# EAGLE schematic secondary_18 (EAGLE 6.1)
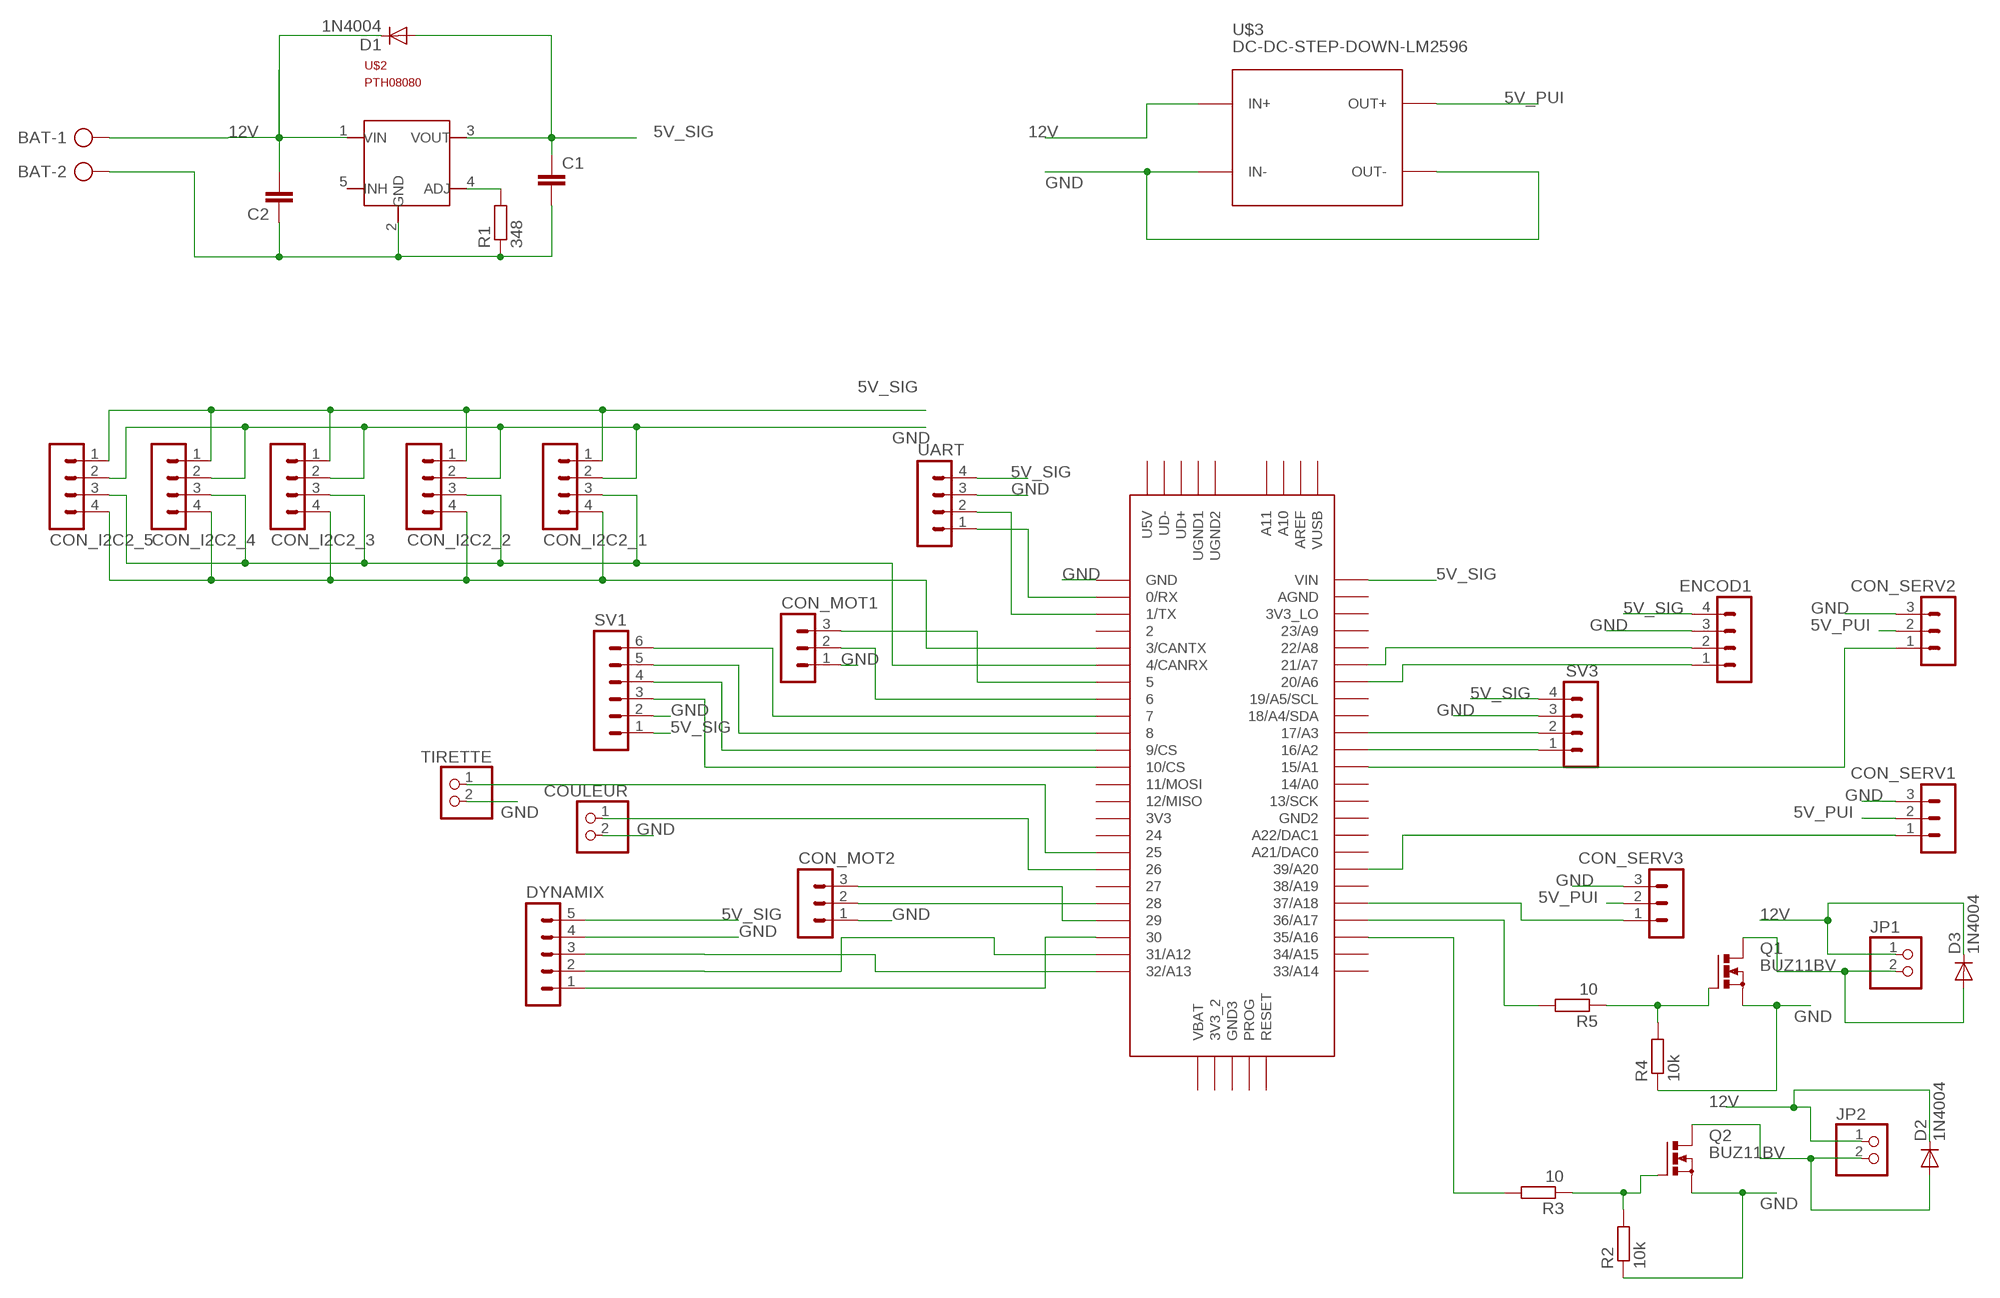
[diagram p0: schematic, sheet 1]

## Parts
BAT  AK300/2  [AK300/2]
C1  C-EU025-060X050  [C025-060X050]
C2  C-EU025-060X050  [C025-060X050]
CON_I2C2_1  MA04-1  [MA04-1]
CON_I2C2_2  MA04-1  [MA04-1]
CON_I2C2_3  MA04-1  [MA04-1]
CON_I2C2_4  MA04-1  [MA04-1]
CON_I2C2_5  MA04-1  [MA04-1]
CON_MOT1  MA03-1  [MA03-1]
CON_MOT2  MA03-1  [MA03-1]
CON_SERV1  MA03-1  [MA03-1]
CON_SERV2  MA03-1  [MA03-1]
CON_SERV3  MA03-1  [MA03-1]
COULEUR  PINHD-1X2  [1X02]
D1  1N4004  [DO41-10]
D2  1N4004  [DO41-10]
D3  1N4004  [DO41-10]
DYNAMIX  MA05-1  [MA05-1]
ENCOD1  MA04-1  [MA04-1]
JP1  PINHD-1X2  [1X02]
JP2  PINHD-1X2  [1X02]
Q1  BUZ11BV  [TO220BV]
Q2  BUZ11BV  [TO220BV]
R1  348  R-EU_0204/7  [0204/7]
R2  10k  R-EU_0204/7  [0204/7]
R3  10  R-EU_0204/7  [0204/7]
R4  10k  R-EU_0204/7  [0204/7]
R5  10  R-EU_0204/7  [0204/7]
SV1  MA06-1  [MA06-1]
SV3  MA04-1  [MA04-1]
TIRETTE  PINHD-1X2  [1X02]
U$1  TEENSY_3.5/3.6  [TEENSY_3.5/3.6]
U$2  PTH08080  [PTH08080EUF]
U$3  DC-DC-STEP-DOWN-LM2596  [DC-DC-STEP-DOWN-LM2596]
UART  MA04-1  [MA04-1]

## Nets
5V_PUI: CON_SERV1.2 CON_SERV2.2 CON_SERV3.2 U$3.OUT+
5V_SIG: C1.1 CON_I2C2_1.1 CON_I2C2_2.1 CON_I2C2_3.1 CON_I2C2_4.1 CON_I2C2_5.1 D1.A DYNAMIX.5 ENCOD1.4 SV1.1 SV3.4 U$1.VIN U$2.3(VOUT) UART.4
12V: BAT.1 C2.2 D1.C D2.C D3.C JP1.1 JP2.1 U$2.1(VIN) U$3.IN+
GND: BAT.2 C1.2 C2.1 CON_I2C2_1.2 CON_I2C2_2.2 CON_I2C2_3.2 CON_I2C2_4.2 CON_I2C2_5.2 CON_MOT1.1 CON_MOT2.1 CON_SERV1.3 CON_SERV2.3 CON_SERV3.3 COULEUR.2 DYNAMIX.4 ENCOD1.3 Q1.S Q2.S R1.1 R2.1 R4.1 SV1.2 SV3.3 TIRETTE.2 U$1.GND U$2.2(GND) U$3.IN- U$3.OUT- UART.3
N$1: R1.2 U$2.4(ADJ)
N$2: CON_MOT2.3 U$1.29
N$3: CON_MOT1.3 U$1.5
N$4: CON_MOT1.2 U$1.6
N$5: CON_MOT2.2 U$1.28
N$6: Q2.G R2.2 R3.1
N$7: R3.2 U$1.35/A16
N$8: D2.A JP2.2 Q2.D
N$9: SV3.1 U$1.16/A2
N$10: Q1.G R4.2 R5.1
N$11: R5.2 U$1.36/A17
N$12: D3.A JP1.2 Q1.D
N$13: SV3.2 U$1.17/A3
N$14: ENCOD1.1 U$1.20/A6
N$15: ENCOD1.2 U$1.21/A7
N$16: CON_SERV2.1 U$1.15/A1
N$17: CON_SERV3.1 U$1.37/A18
N$18: DYNAMIX.3 U$1.32/A13
N$19: CON_SERV1.1 U$1.39/A20
N$20: DYNAMIX.2 U$1.31/A12
N$21: CON_I2C2_1.4 CON_I2C2_2.4 CON_I2C2_3.4 CON_I2C2_4.4 CON_I2C2_5.4 U$1.3/CANTX
N$22: COULEUR.1 U$1.26
N$23: CON_I2C2_1.3 CON_I2C2_2.3 CON_I2C2_3.3 CON_I2C2_4.3 CON_I2C2_5.3 U$1.4/CANRX
N$24: DYNAMIX.1 U$1.30
N$25: TIRETTE.1 U$1.25
N$26: U$1.1/TX UART.2
N$27: U$1.0/RX UART.1
N$30: SV1.3 U$1.10/CS
N$31: SV1.4 U$1.9/CS
N$32: SV1.5 U$1.8
N$33: SV1.6 U$1.7
Unconnected: U$1.2 U$1.3V3 U$1.3V3_2 U$1.3V3_LO U$1.11/MOSI U$1.12/MISO U$1.13/SCK U$1.14/A0 U$1.18/A4/SDA U$1.19/A5/SCL U$1.21/DAC0(A21/DAC0) U$1.22/A8 U$1.23/A9 U$1.24 U$1.27 U$1.33/A14 U$1.34/A15 U$1.38/A19 U$1.A10 U$1.A11 U$1.A22/DAC1 U$1.AGND U$1.AREF U$1.GND2 U$1.GND3 U$1.PROG U$1.RESET U$1.U5V U$1.UD+ U$1.UD- U$1.UGND1 U$1.UGND2 U$1.VBAT U$1.VUSB U$2.5(INH)

## Library data of the parts
BAT = con-ptr500:AK300/2: CONNECTOR; OC_FARNELL: unknown; OC_NEWARK: unknown
C1 C2 = rcl:C-EU: CAPACITOR, European symbol
CON_I2C2_1-CON_I2C2_5 ENCOD1 SV3 UART = con-lstb:MA04-1: PIN HEADER; OC_FARNELL: unknown; OC_NEWARK: unknown
CON_MOT1 CON_MOT2 CON_SERV1-CON_SERV3 = con-lstb:MA03-1: PIN HEADER; OC_FARNELL: unknown; OC_NEWARK: unknown
COULEUR JP1 JP2 TIRETTE = pinhead:PINHD-1X2: PIN HEADER
D1-D3 = diode:1N4004: DIODE general purpose rectifier, 1 A
DYNAMIX = con-lstb:MA05-1: PIN HEADER; OC_FARNELL: unknown; OC_NEWARK: unknown
Q1 Q2 = transistor-power:BUZ11: N-CHANNEL MOS FET
R1-R5 = resistor:R-EU_: RESISTOR, European symbol
SV1 = con-lstb:MA06-1: PIN HEADER; OC_FARNELL: unknown; OC_NEWARK: unknown
U$1 = Teensy356:TEENSY_3.5/3.6
U$2 = pth08080:PTH08080: DC-DC, Vin 5..18V, Vout 2..6V, 2A www.ti.com
U$3 = diy-modules:DC-DC-STEP-DOWN-LM2596: DC/DC Step-Down Regulator based on LM2596-ADJ chip LM2596 datasheet available here: http://www.ti.com/lit/ds/symlink/lm2596.pdf Click here to find device on ebay.com <http://www.ebay.com/sch/lm2596+power+regulator>